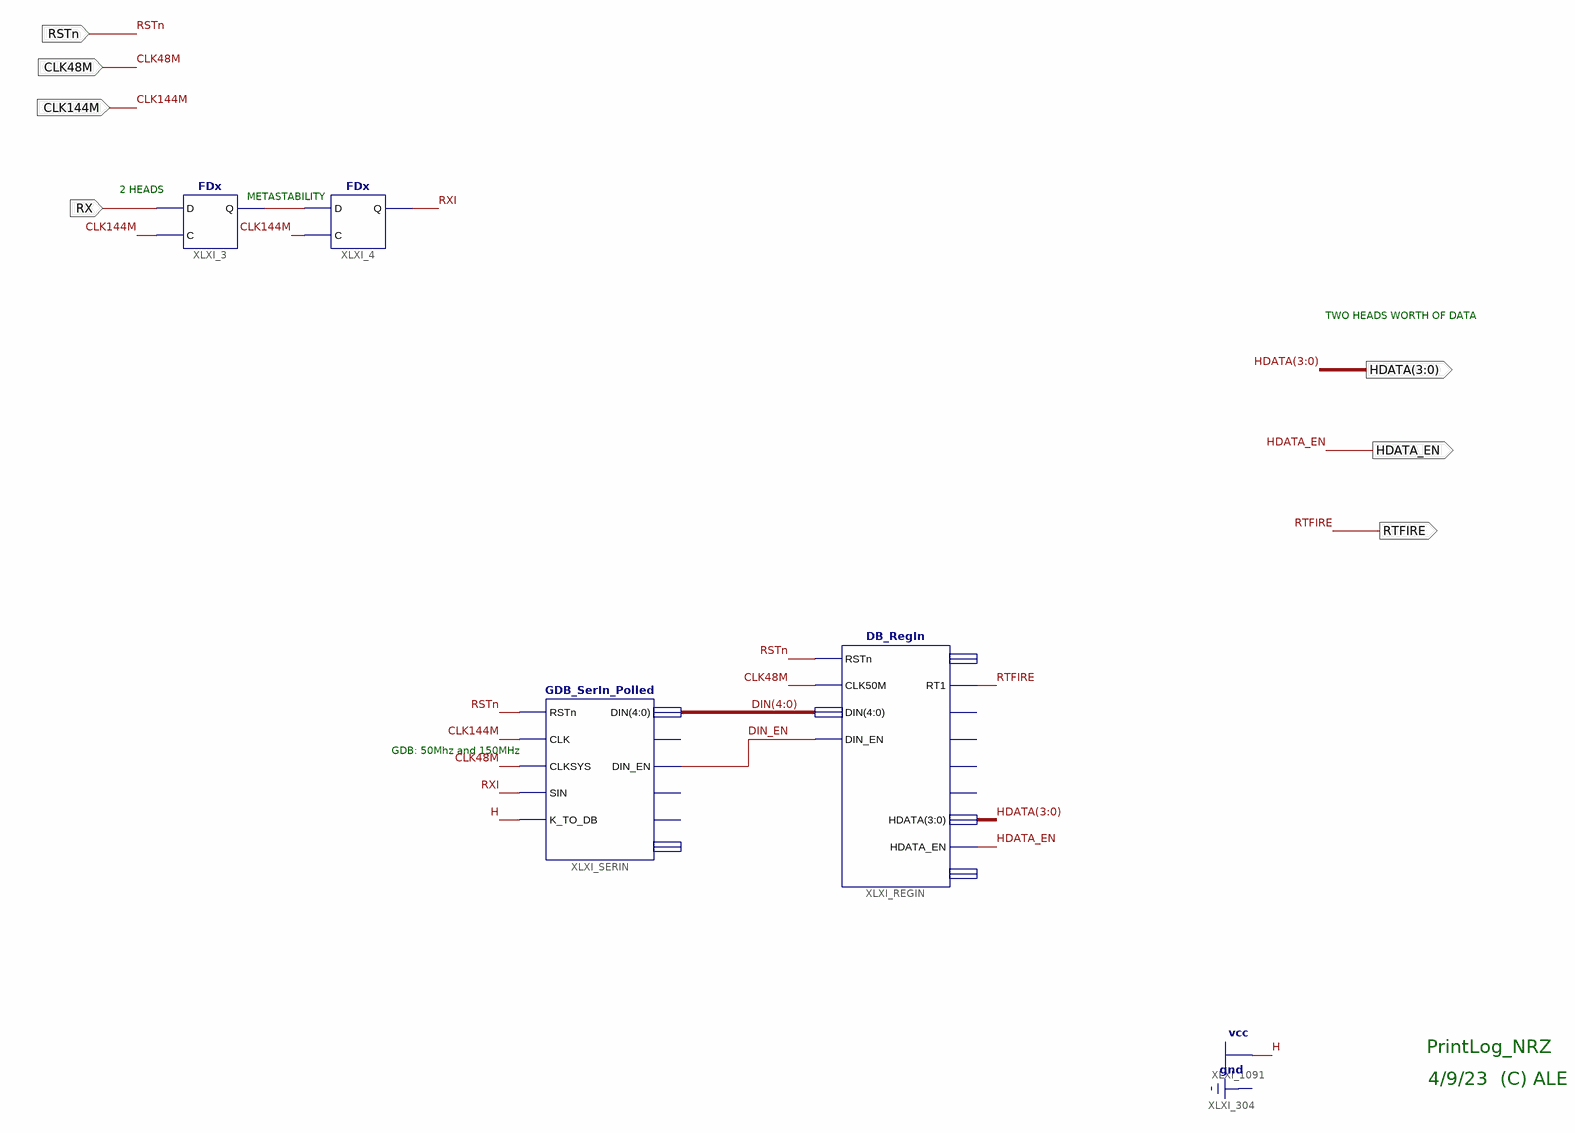
[diagram p0: schematic sheet 1]
// Xilinx ISE schematic PrintLog_NRZ.sch (spartan3e) as structural Verilog: 4 symbols, 7 ports
module PrintLog_NRZ (
  input  RX,
  input  RSTn,
  input  CLK48M,
  input  CLK144M,
  output RTFIRE,
  output [3:0] HDATA,
  output HDATA_EN
);

  wire DIN_EN, RXI, XLXN_4;
  wire [4:0] DIN;

  FDx XLXI_3 (.C(CLK144M), .D(RX), .Q(XLXN_4));
  FDx XLXI_4 (.C(CLK144M), .D(XLXN_4), .Q(RXI));
  DB_RegIn XLXI_REGIN (
    .CLK50M(CLK48M), .DIN(DIN), .DIN_EN(DIN_EN), .HDATA(HDATA), .HDATA_EN(HDATA_EN), .RSTn(RSTn), .RT1(RTFIRE));  // open: REGS, RT2L, RT3, RT4, RTEN, TP
  GDB_SerIn_Polled XLXI_SERIN (
    .CLK(CLK144M), .CLKSYS(CLK48M), .DIN(DIN), .DIN_EN(DIN_EN), .K_TO_DB(1'b1), .RSTn(RSTn), .SIN(RXI));  // open: EDGE, ISDATA, SYNC, TP

  // Notes on the sheet:
  //   2 HEADS
  //   METASTABILITY
  //   TWO HEADS WORTH OF DATA
  //   GDB: 50Mhz and 150MHz
  //   PrintLog_NRZ
  //   4/9/23  (C) ALE
endmodule
